# Altium schematic sheet TopLevel.SchDoc
size A
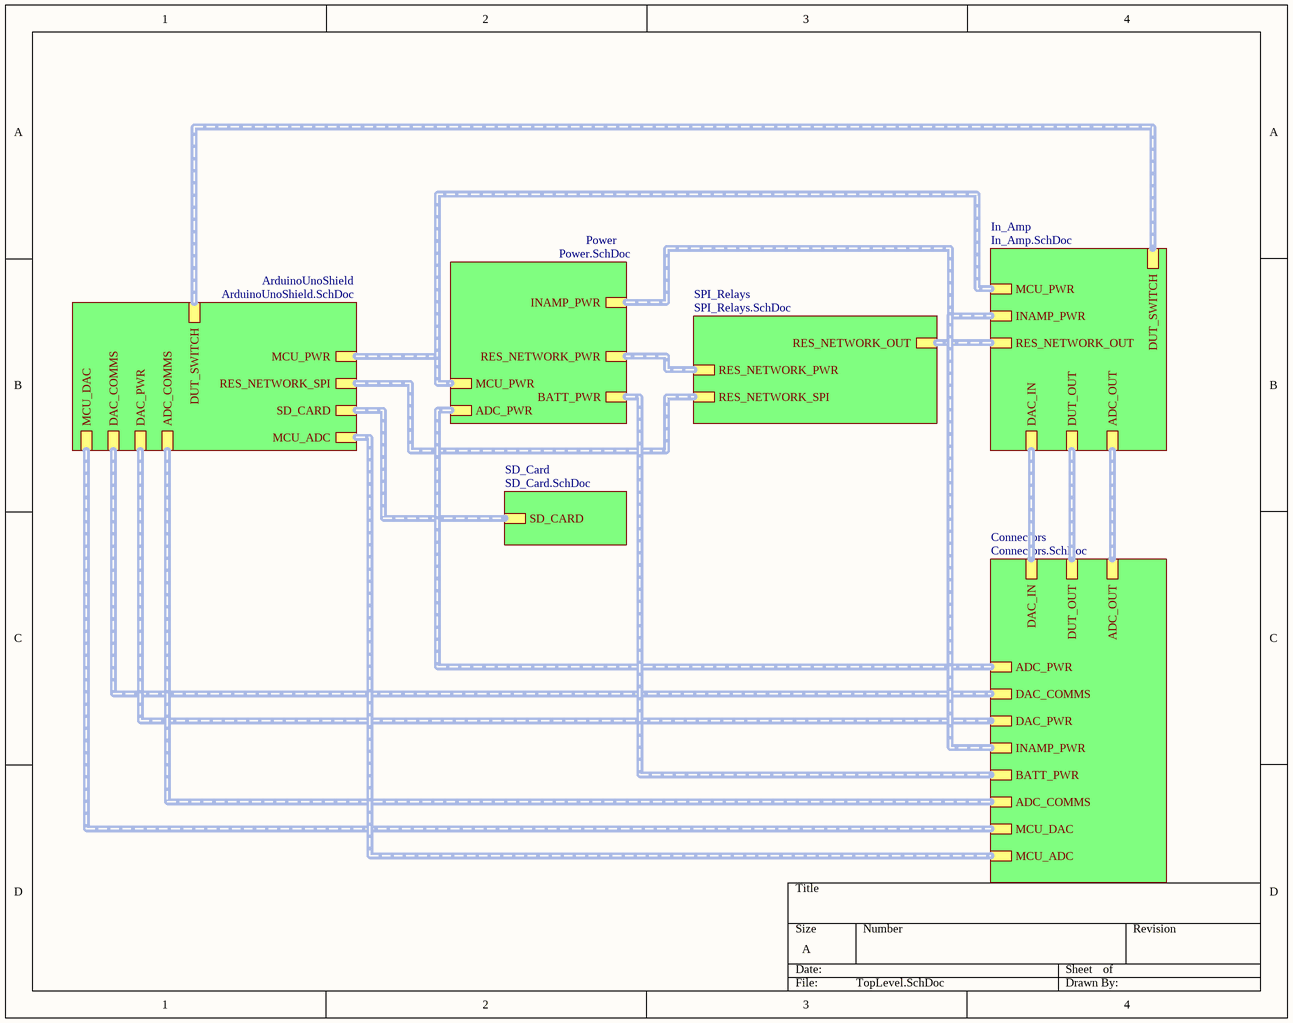
[diagram p0: TopLevel.SchDoc]

## Sub-sheets
ArduinoUnoShield = ArduinoUnoShield.SchDoc: SD_CARD (harness SD_CARD), RES_NETWORK_SPI (harness RES_NETWORK_SPI), MCU_PWR (harness MCU_PWR), MCU_DAC (harness MCU_DAC), DAC_COMMS (harness DAC_COMMS), DAC_PWR (harness DAC_PWR), ADC_COMMS (harness ADC_COMMS), DUT_SWITCH (harness DUT_SWITCH), MCU_ADC (harness MCU_ADC)
Connectors = Connectors.SchDoc: DAC_IN (harness DAC_IN), DUT_OUT (harness DUT_OUT), ADC_OUT (harness ADC_OUT), ADC_PWR (harness ADC_PWR), DAC_COMMS (harness DAC_COMMS), DAC_PWR (harness DAC_PWR), INAMP_PWR (harness INAMP_PWR), BATT_PWR (harness BATT_PWR), ADC_COMMS (harness ADC_COMMS), MCU_DAC (harness MCU_DAC), MCU_ADC (harness MCU_ADC)
In_Amp = In_Amp.SchDoc: RES_NETWORK_OUT (harness RES_NETWORK_OUT), DAC_IN (harness DAC_IN), DUT_OUT (harness DUT_OUT), ADC_OUT (harness ADC_OUT), INAMP_PWR (harness INAMP_PWR), MCU_PWR (harness MCU_PWR), DUT_SWITCH (harness DUT_SWITCH)
Power = Power.SchDoc: RES_NETWORK_PWR (harness RES_NETWORK_PWR), MCU_PWR (harness MCU_PWR), ADC_PWR (harness ADC_PWR), INAMP_PWR (harness INAMP_PWR), BATT_PWR (harness BATT_PWR)
SD_Card = SD_Card.SchDoc: SD_CARD (harness SD_CARD)
SPI_Relays = SPI_Relays.SchDoc: RES_NETWORK_OUT (harness RES_NETWORK_OUT), RES_NETWORK_PWR (harness RES_NETWORK_PWR), RES_NETWORK_SPI (harness RES_NETWORK_SPI)

## Buses and harness runs
harness sheet ArduinoUnoShield/ADC_COMMS = sheet Connectors/ADC_COMMS
harness sheet ArduinoUnoShield/DAC_COMMS = sheet Connectors/DAC_COMMS
harness sheet ArduinoUnoShield/DAC_PWR = sheet Connectors/DAC_PWR
harness sheet ArduinoUnoShield/DUT_SWITCH = sheet In_Amp/DUT_SWITCH
harness sheet ArduinoUnoShield/MCU_ADC = sheet Connectors/MCU_ADC
harness sheet ArduinoUnoShield/MCU_DAC = sheet Connectors/MCU_DAC
harness sheet ArduinoUnoShield/MCU_PWR = sheet In_Amp/MCU_PWR = sheet Power/MCU_PWR
harness sheet ArduinoUnoShield/RES_NETWORK_SPI = sheet SPI_Relays/RES_NETWORK_SPI
harness sheet ArduinoUnoShield/SD_CARD = sheet SD_Card/SD_CARD
harness sheet Connectors/ADC_OUT = sheet In_Amp/ADC_OUT
harness sheet Connectors/ADC_PWR = sheet Power/ADC_PWR
harness sheet Connectors/BATT_PWR = sheet Power/BATT_PWR
harness sheet Connectors/DAC_IN = sheet In_Amp/DAC_IN
harness sheet Connectors/DUT_OUT = sheet In_Amp/DUT_OUT
harness sheet Connectors/INAMP_PWR = sheet In_Amp/INAMP_PWR = sheet Power/INAMP_PWR
harness sheet In_Amp/RES_NETWORK_OUT = sheet SPI_Relays/RES_NETWORK_OUT
harness sheet Power/RES_NETWORK_PWR = sheet SPI_Relays/RES_NETWORK_PWR